# Altium schematic sheet 4_viper_eagle_modern_periferals.SchDoc: =ProjectTitle
size A4; Address1: github.com/4pplet/eagle_viper; Address2: Licence: CERN-OHL-S; Address4: www.4pplet.com; SheetNumber: 4; SheetTotal: 5
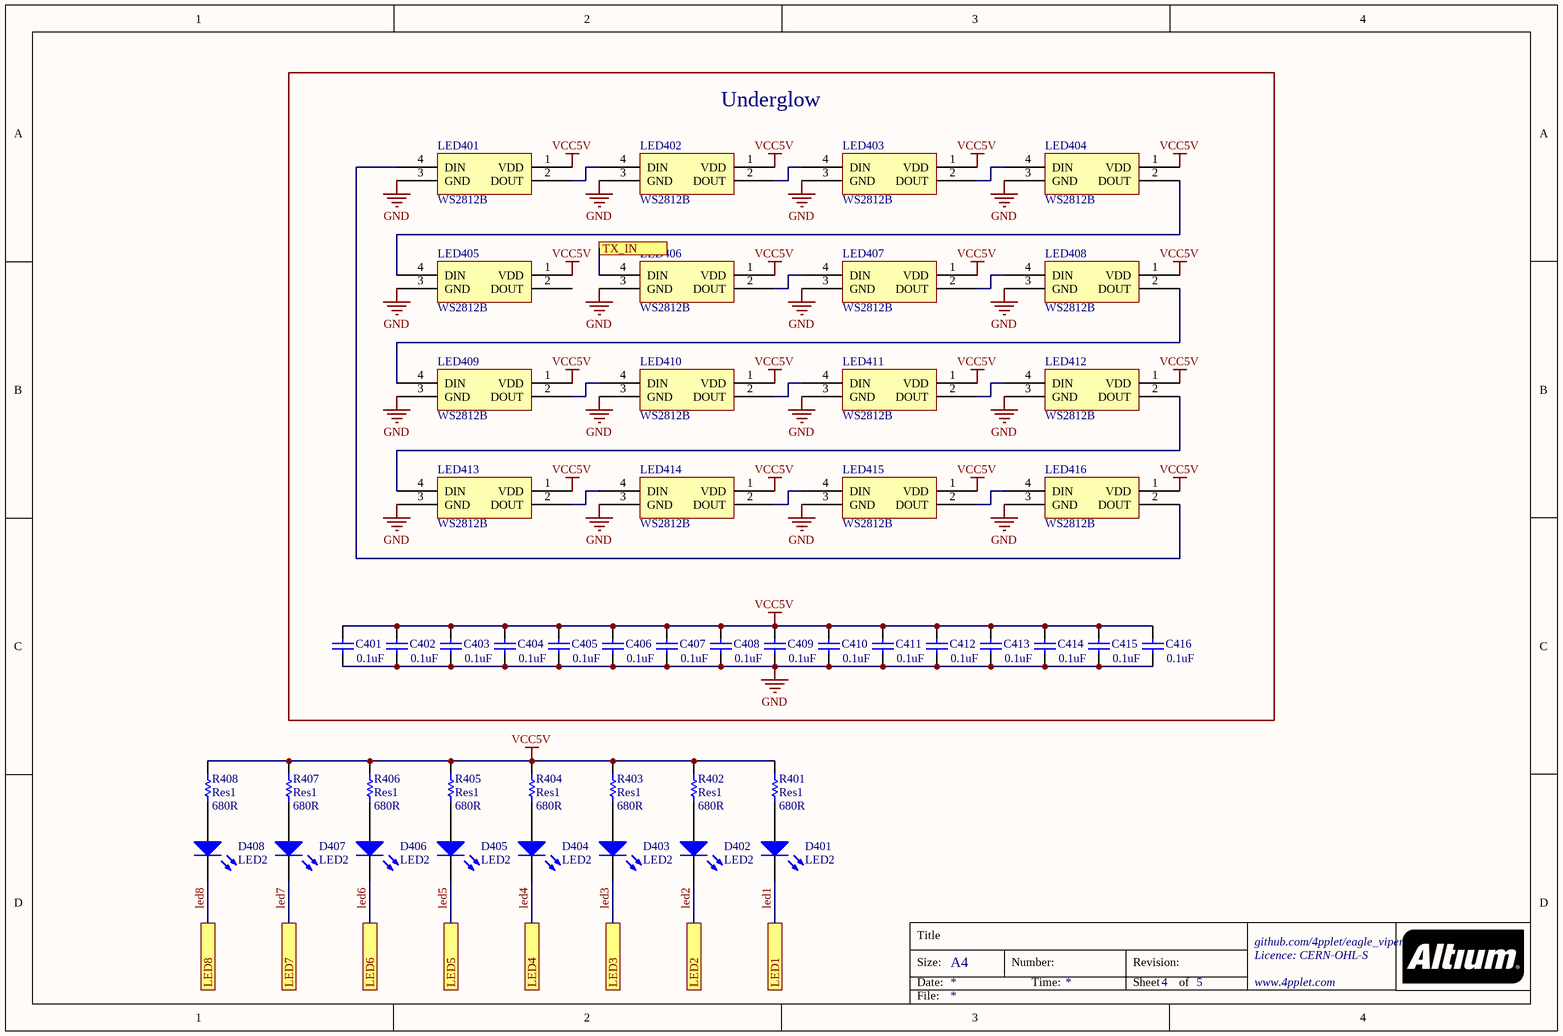
[diagram p0: 4_viper_eagle_modern_periferals.SchDoc]

## Parts
C401  value 0.1uF  [C0603[1608]]
C402  value 0.1uF  [C0603[1608]]
C403  value 0.1uF  [C0603[1608]]
C404  value 0.1uF  [C0603[1608]]
C405  value 0.1uF  [C0603[1608]]
C406  value 0.1uF  [C0603[1608]]
C407  value 0.1uF  [C0603[1608]]
C408  value 0.1uF  [C0603[1608]]
C409  value 0.1uF  [C0603[1608]]
C410  value 0.1uF  [C0603[1608]]
C411  value 0.1uF  [C0603[1608]]
C412  value 0.1uF  [C0603[1608]]
C413  value 0.1uF  [C0603[1608]]
C414  value 0.1uF  [C0603[1608]]
C415  value 0.1uF  [C0603[1608]]
C416  value 0.1uF  [C0603[1608]]
D401  LED2  [LED - THT]
D402  LED2  [LED - THT]
D403  LED2  [LED - THT]
D404  LED2  [LED - THT]
D405  LED2  [LED - THT]
D406  LED2  [LED - THT]
D407  LED2  [LED - THT]
D408  LED2  [LED - THT]
LED401  WS2812B  [WS2812B]
LED402  WS2812B  [WS2812B]
LED403  WS2812B  [WS2812B]
LED404  WS2812B  [WS2812B]
LED405  WS2812B  [WS2812B]
LED406  WS2812B  [WS2812B]
LED407  WS2812B  [WS2812B]
LED408  WS2812B  [WS2812B]
LED409  WS2812B  [WS2812B]
LED410  WS2812B  [WS2812B]
LED411  WS2812B  [WS2812B]
LED412  WS2812B  [WS2812B]
LED413  WS2812B  [WS2812B]
LED414  WS2812B  [WS2812B]
LED415  WS2812B  [WS2812B]
LED416  WS2812B  [WS2812B]
R401  Res1  value 680R  [R0603[1608]]
R402  Res1  value 680R  [R0603[1608]]
R403  Res1  value 680R  [R0603[1608]]
R404  Res1  value 680R  [R0603[1608]]
R405  Res1  value 680R  [R0603[1608]]
R406  Res1  value 680R  [R0603[1608]]
R407  Res1  value 680R  [R0603[1608]]
R408  Res1  value 680R  [R0603[1608]]

## Blocks framed on the sheet
Underglow: C401-C416 LED401-LED416

## Ports
LED1, LED2, LED3, LED4, LED5, LED6, LED7, LED8, TX_IN

## Nets
GND: C401.1 C402.1 C403.1 C404.1 C405.1 C406.1 C407.1 C408.1 C409.1 C410.1 C411.1 C412.1 C413.1 C414.1 C415.1 C416.1 LED401.3(GND) LED402.3(GND) LED403.3(GND) LED404.3(GND) LED405.3(GND) LED406.3(GND) LED407.3(GND) LED408.3(GND) LED409.3(GND) LED410.3(GND) LED411.3(GND) LED412.3(GND) LED413.3(GND) LED414.3(GND) LED415.3(GND) LED416.3(GND)
VCC5V: C401.2 C402.2 C403.2 C404.2 C405.2 C406.2 C407.2 C408.2 C409.2 C410.2 C411.2 C412.2 C413.2 C414.2 C415.2 C416.2 LED401.1(VDD) LED402.1(VDD) LED403.1(VDD) LED404.1(VDD) LED405.1(VDD) LED406.1(VDD) LED407.1(VDD) LED408.1(VDD) LED409.1(VDD) LED410.1(VDD) LED411.1(VDD) LED412.1(VDD) LED413.1(VDD) LED414.1(VDD) LED415.1(VDD) LED416.1(VDD) R401.1 R402.1 R403.1 R404.1 R405.1 R406.1 R407.1 R408.1
led1: D401.2(K) ; port LED1
led2: D402.2(K) ; port LED2
led3: D403.2(K) ; port LED3
led4: D404.2(K) ; port LED4
led5: D405.2(K) ; port LED5
led6: D406.2(K) ; port LED6
led7: D407.2(K) ; port LED7
led8: D408.2(K) ; port LED8
TX_IN: LED406.4(DIN) ; port TX_IN
NetD401_1: D401.1(A) R401.2
NetD402_1: D402.1(A) R402.2
NetD403_1: D403.1(A) R403.2
NetD404_1: D404.1(A) R404.2
NetD405_1: D405.1(A) R405.2
NetD406_1: D406.1(A) R406.2
NetD407_1: D407.1(A) R407.2
NetD408_1: D408.1(A) R408.2
NetLED401_2: LED401.2(DOUT) LED402.4(DIN)
NetLED401_4: LED401.4(DIN) LED416.2(DOUT)
NetLED402_2: LED402.2(DOUT) LED403.4(DIN)
NetLED403_2: LED403.2(DOUT) LED404.4(DIN)
NetLED404_2: LED404.2(DOUT) LED405.4(DIN)
NetLED406_2: LED406.2(DOUT) LED407.4(DIN)
NetLED407_2: LED407.2(DOUT) LED408.4(DIN)
NetLED408_2: LED408.2(DOUT) LED409.4(DIN)
NetLED409_2: LED409.2(DOUT) LED410.4(DIN)
NetLED410_2: LED410.2(DOUT) LED411.4(DIN)
NetLED411_2: LED411.2(DOUT) LED412.4(DIN)
NetLED412_2: LED412.2(DOUT) LED413.4(DIN)
NetLED413_2: LED413.2(DOUT) LED414.4(DIN)
NetLED414_2: LED414.2(DOUT) LED415.4(DIN)
NetLED415_2: LED415.2(DOUT) LED416.4(DIN)

Not connected (* = marked no-connect by the designer): LED405 2(DOUT)

## Notes on the sheet
- Title
- Size:
- Date:
- A4
- Number:
- Time:
- Revision:
- Sheet
- of
- File:

## Library data of the parts
C401-C416 = Cap: Capacitor; MRF.Part: CC0603KRX7R9BB104; MFG: KEMET; MFGPN: C0603C104M5RACTU; LCSC MFG: YAGEO; Version: 0603 imperial; LCSC Part #: C14663
D401-D408 = LED2: Typical RED, GREEN, YELLOW, AMBER GaAs LED
LED401-LED416 = WS2812B: MRF.Part: WS2812B-B; LCSC MFG: Worldsemi; LCSC Part #: C114586
R401-R408 = Res1: Resistor; MRF.Part: 0603WAF6800T5E; LCSC MFG: Uniroyal Elec; Version: 0603 imperial; LCSC Part #: C23228